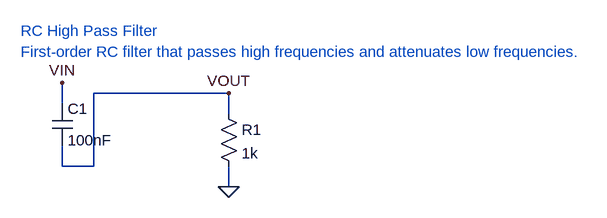
[diagram p0: schematic rc_high_pass_filter.asc]
rc_high_pass_filter.asc, the LTspice schematic file:
Version 4
SHEET 1 1200 800
TEXT 16 16 Left 2 ;RC High Pass Filter
TEXT 16 48 Left 2 ;First-order RC filter that passes high frequencies and attenuates low frequencies.
SYMBOL cap 64 128 R0
SYMATTR InstName C1
SYMATTR Value 100nF
SYMBOL res 320 128 R0
SYMATTR InstName R1
SYMATTR Value 1k
FLAG 80 96 VIN
WIRE 80 96 80 128
FLAG 336 112 VOUT
WIRE 80 192 80 224
WIRE 80 224 128 224
WIRE 128 112 128 224
WIRE 128 112 336 112
WIRE 336 112 336 144
FLAG 336 256 0
WIRE 336 224 336 256

The netlist it stands for:
* rc_high_pass_filter.asc
C1 VIN VOUT 100nF
R1 VOUT 0 1k
* RC High Pass Filter
* First-order RC filter that passes high frequencies and attenuates low frequencies.
.backanno
.end